# EAGLE schematic ADS1299 - Breakout (EAGLE 9.6.2)
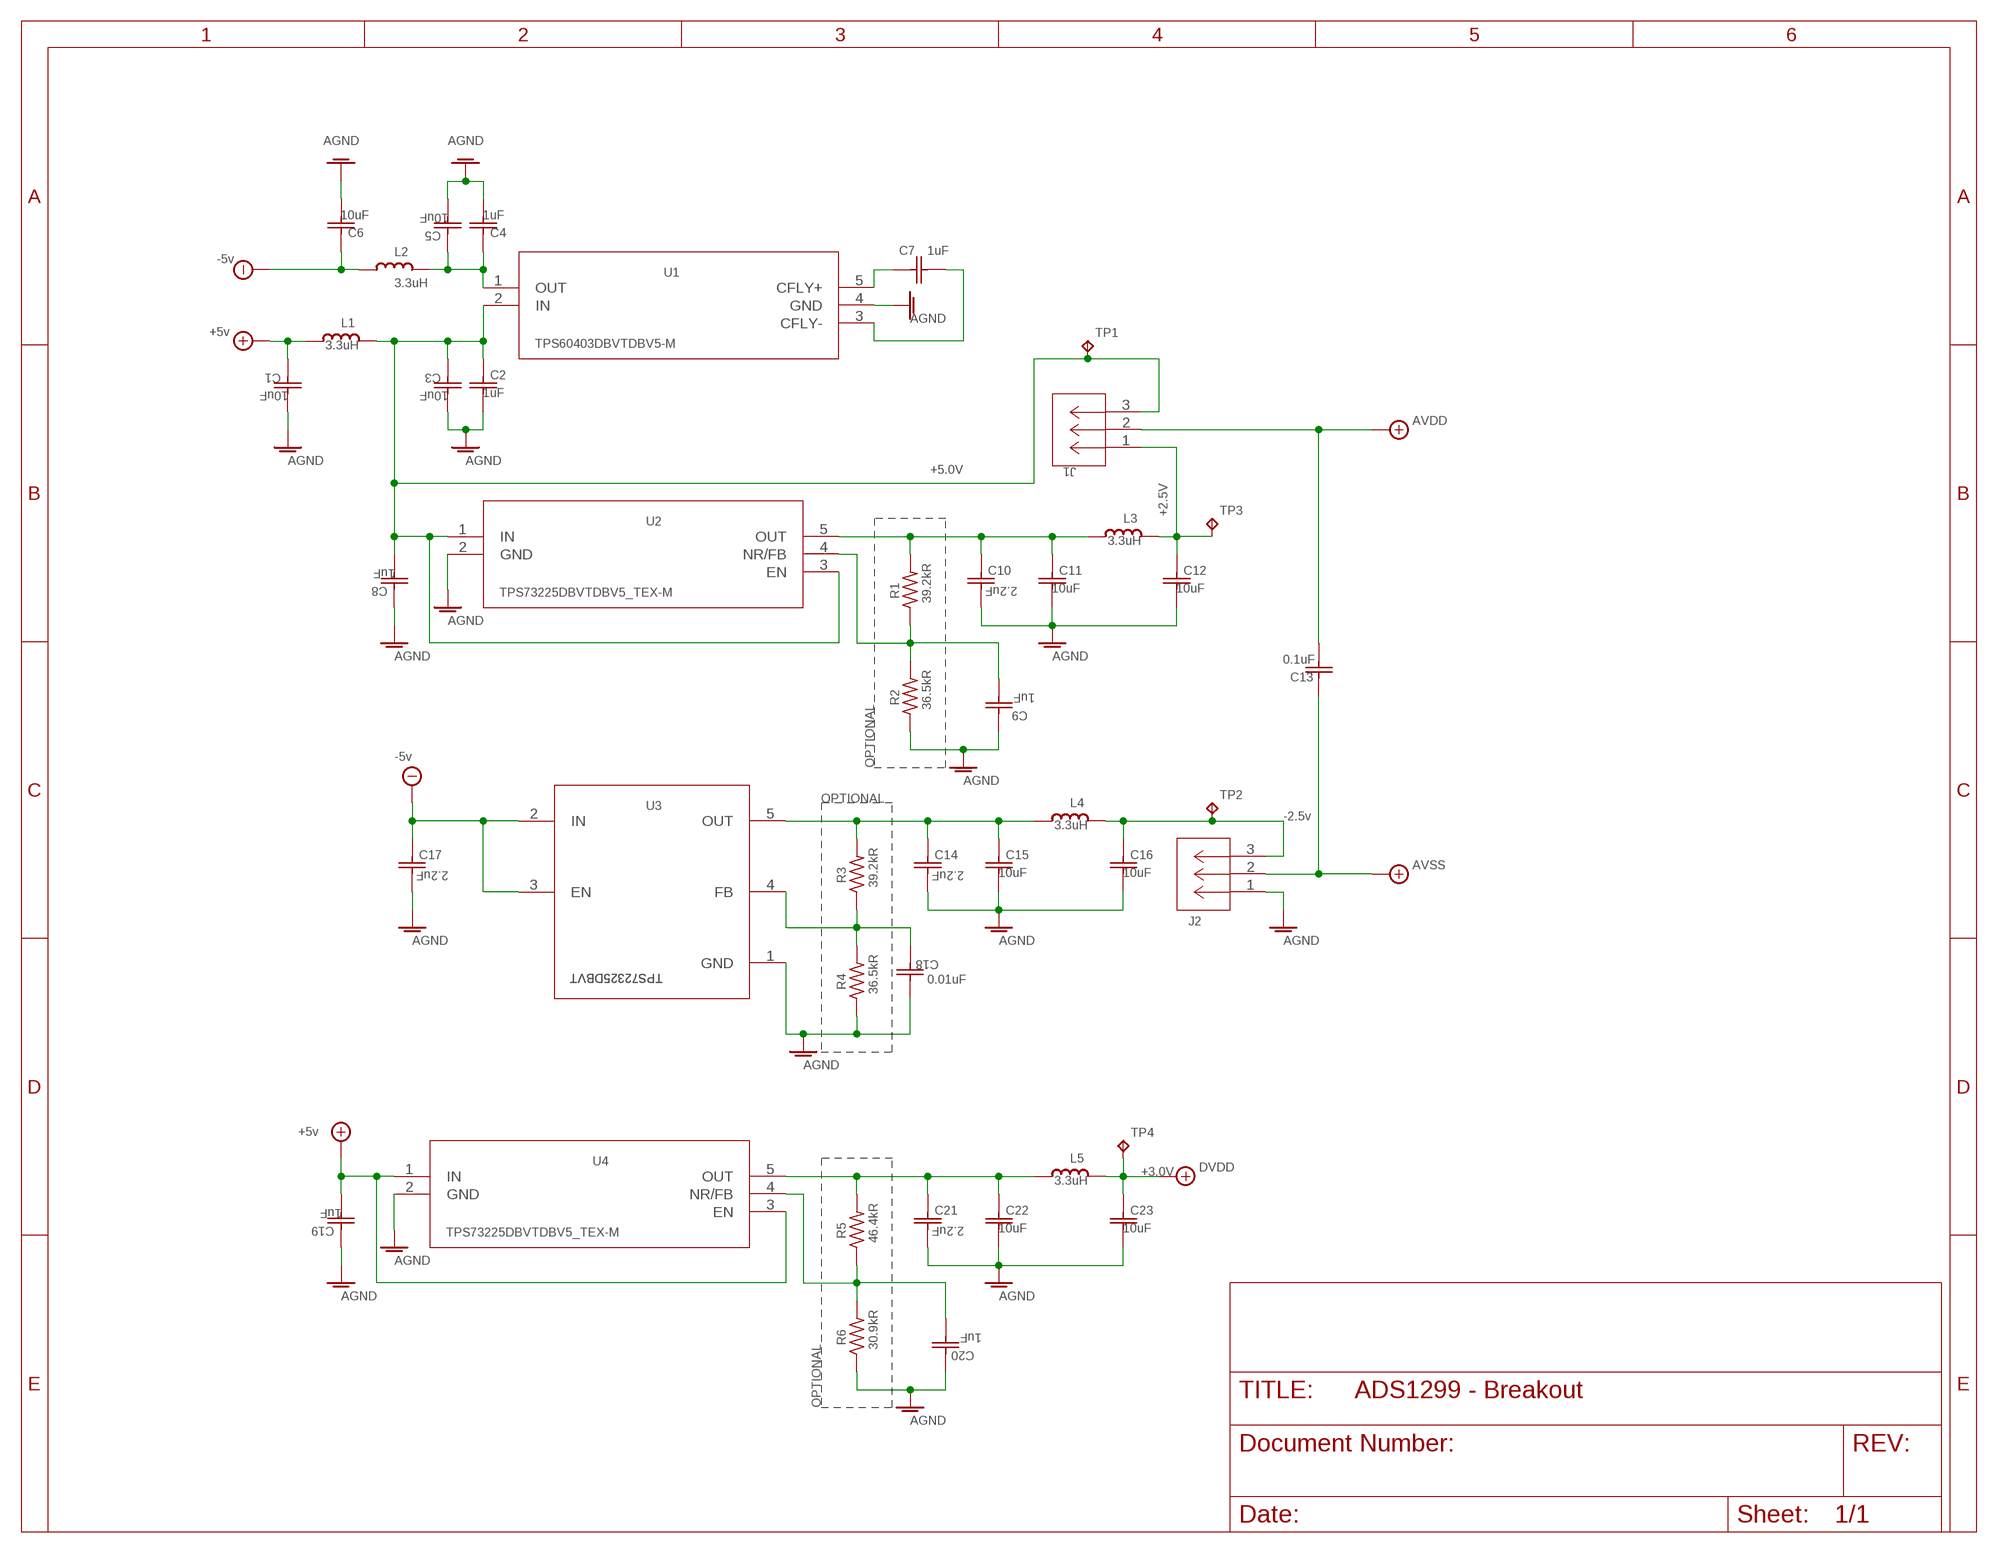
[diagram p0: schematic, sheet 1]

## Parts
C1  10uF  GRM219R61A106KE44DG-21_MUR-M  [G-21_MUR-M]
C2  1uF  GRM188R61E105KA12DG-188_MUR-M  [G-188_MUR-M]
C3  10uF  GRM219R61A106KE44DG-21_MUR-M  [G-21_MUR-M]
C4  1uF  GRM188R61E105KA12DG-188_MUR-M  [G-188_MUR-M]
C5  10uF  GRM219R61A106KE44DG-21_MUR-M  [G-21_MUR-M]
C6  10uF  GRM219R61A106KE44DG-21_MUR-M  [G-21_MUR-M]
C7  1uF  GRM188R61E105KA12DG-188_MUR-M  [G-188_MUR-M]
C8  1uF  GRM188R61E105KA12DG-188_MUR-M  [G-188_MUR-M]
C9  1uF  GRM188R61E105KA12DG-188_MUR-M  [G-188_MUR-M]
C10  2.2uF  GRM185R60J225KE26DCAP_GCJ1888_MUR-M  [CAP_GCJ1888_MUR-M]
C11  10uF  GRM219R61A106KE44DG-21_MUR-M  [G-21_MUR-M]
C12  10uF  GRM219R61A106KE44DG-21_MUR-M  [G-21_MUR-M]
C13  0.1uF  GRM188R71H104KA93DCAP_GRM_188_MUR-M  [CAP_GRM_188_MUR-M]
C14  2.2uF  GRM185R60J225KE26DCAP_GCJ1888_MUR-M  [CAP_GCJ1888_MUR-M]
C15  10uF  GRM219R61A106KE44DG-21_MUR-M  [G-21_MUR-M]
C16  10uF  GRM219R61A106KE44DG-21_MUR-M  [G-21_MUR-M]
C17  2.2uF  GRM185R60J225KE26DCAP_GCJ1888_MUR-M  [CAP_GCJ1888_MUR-M]
C18  0.01uF  GRM188R71H472KA01DG-188_MUR-M  [G-188_MUR-M]
C19  1uF  GRM188R61E105KA12DG-188_MUR-M  [G-188_MUR-M]
C20  1uF  GRM188R61E105KA12DG-188_MUR-M  [G-188_MUR-M]
C21  2.2uF  GRM185R60J225KE26DCAP_GCJ1888_MUR-M  [CAP_GCJ1888_MUR-M]
C22  10uF  GRM219R61A106KE44DG-21_MUR-M  [G-21_MUR-M]
C23  10uF  GRM219R61A106KE44DG-21_MUR-M  [G-21_MUR-M]
J1  TSW-103-07-T-S  [CON3_1X3_TU_TSW]
J2  TSW-103-07-T-S  [CON3_1X3_TU_TSW]
L1  3.3uH  L_0805  [L0805]
L2  3.3uH  L_0805  [L0805]
L3  3.3uH  L_0805  [L0805]
L4  3.3uH  L_0805  [L0805]
L5  3.3uH  L_0805  [L0805]
R1  39.2kR  R-US_R0603  [R0603]
R2  36.5kR  R-US_R0603  [R0603]
R3  39.2kR  R-US_R0603  [R0603]
R4  36.5kR  R-US_R0603  [R0603]
R5  46.4kR  R-US_R0603  [R0603]
R6  30.9kR  R-US_R0603  [R0603]
TP1  TP-040  [TP-040]
TP2  TP-040  [TP-040]
TP3  TP-040  [TP-040]
TP4  TP-040  [TP-040]
U1  TPS60403DBVTDBV5-M  [DBV5-M]
U2  TPS73225DBVTDBV5_TEX-M  [DBV5_TEX-M]
U3  TPS72325DBVT  [DBV0005A]
U4  TPS73225DBVTDBV5_TEX-M  [DBV5_TEX-M]

## Nets
+2.5V: C12.2 J1.1 L3.1 TP3.1
+3.0V: C23.2 L5.1 TP4.1 ; supply symbol labelled DVDD
+5.0V: C2.1 C3.1 C8.1 J1.3 L1.1 TP1.1 U1.2(IN) U2.1(IN) U2.3(EN)
+5V: C1.2 C13.1 C13.2 C19.1 J1.2 J2.2 L1.2 U4.1(IN) U4.3(EN) ; supply symbol labelled AVDD, AVSS, +5v
-5V: C6.1 C17.2 L2.2 U3.2(IN) U3.3(EN) ; supply symbol labelled -5v
AGND: C1.1 C2.2 C3.2 C4.2 C5.2 C6.2 C8.2 C9.2 C10.1 C11.1 C12.1 C14.1 C15.1 C16.1 C17.1 C18.1 C19.2 C20.2 C21.1 C22.1 C23.1 J2.1 R2.1 R4.1 R6.1 U1.4(GND) U2.2(GND) U3.1(GND) U4.2(GND)
N$1: C16.2 J2.3 L4.1 TP2.1
N$2: C4.1 C5.1 L2.1 U1.1(OUT)
N$3: C7.2 U1.5(CFLY+)
N$4: C7.1 U1.3(CFLY-)
N$5: C9.1 R1.1 R2.2 U2.4(NR/FB)
N$6: C10.2 C11.2 L3.2 R1.2 U2.5(OUT)
N$7: C14.2 C15.2 L4.2 R3.2 U3.5(OUT)
N$8: C18.2 R3.1 R4.2 U3.4(FB)
N$9: C20.1 R5.1 R6.2 U4.4(NR/FB)
N$10: C21.2 C22.2 L5.2 R5.2 U4.5(OUT)

## Notes on the sheet
- +5.0V
- OPTIONAL
- OPTIONAL
- -2.5v
- OPTIONAL

## Library data of the parts
C1 C3 C5 C6 C11 C12 C15 C16 C22 C23 = GRM219R61A106KE44D:GRM219R61A106KE44D; COPYRIGHT: Copyright (C) 2015 Accelerated Designs. All rights reserved; MANUFACTURER_PART_NUMBER: GRM219R61A106KE44D; SOURCELIBRARY: Murata_2014-12-31; VENDOR: Murata
C2 C4 C7-C9 C19 C20 = GRM188R61E105KA12D:GRM188R61E105KA12D; COPYRIGHT: Copyright (C) 2015 Accelerated Designs. All rights reserved; MANUFACTURER_PART_NUMBER: GRM188R61E105KA12D; SOURCELIBRARY: Murata_2014-12-31; VENDOR: Murata
C10 C14 C17 C21 = GRM185R60J225KE26D:GRM185R60J225KE26D; COPYRIGHT: Copyright (C) 2015 Accelerated Designs. All rights reserved; MANUFACTURER_PART_NUMBER: GRM185R60J225KE26D; SOURCELIBRARY: Murata_2014-12-31; VENDOR: Murata
C13 = GRM188R71H104KA93D:GRM188R71H104KA93D; CAPACITANCE: 0.1µF; COPYRIGHT: Copyright (C) 2015 Accelerated Designs. All rights reserved; CURRENT_RATING: Unknown; DATASHEET: http://search.murata.co.jp/Ceramy/image/img/PDF/ENG/GRM188R71H104KA93.pdf; DESCRIPTION: CAP CER .1UF 50V 10% X7R 0603; DIGIKEYPARTNUMBER: 490-1519-6-ND; FEATURES: General Purpose; HEADER_GROUP: Capacitors; HEADER_SECTION: Passives; LEAD_SPACING: -; MANUFACTURER_NAME: Murata; MANUFACTURER_PART_NUMBER: GRM188R71H104KA93D; MOUNTING: Surface Mount; MOUNTING_TYPE: Surface Mount, MLCC; OPERATING_TEMPERATURE: -55°C ~ 125°C; PACKAGE-CASE: 0603; PACKAGE_-_CASE: 0603 (1608 metric); PACKAGING: Digi-Reel®; QUANTITY_AVAILABLE: 3072080; R-S_NUMBER: 6242480; SOURCELIBRARY: Murata_2014-12-31; TEMPERATURE_COEFFICIENT: X7R; THICKNESS: 0.80mm; TOLERANCE: 0.1; VALUE: 100nF; VENDOR: Murata; VOLTAGE: Unknown; VOLTAGE_-_RATED: 50V
C18 = GRM188R71H472KA01D:GRM188R71H472KA01D; COPYRIGHT: Copyright (C) 2015 Accelerated Designs. All rights reserved; MANUFACTURER_PART_NUMBER: GRM188R71H472KA01D; SOURCELIBRARY: Murata_2014-12-31; VENDOR: Murata
J1 J2 = TSW-103-07-T-S:TSW-103-07-T-S; BUILT_BY: EMA_UL_Team; MANUFACTURER_PART_NUMBER: TSW-103-07-T-S; VENDOR: Samtec Inc
L1-L5 = rc-master-smd:L_: INDUCTOR
R1-R6 = rcl:R-US_: RESISTOR, American symbol; SPICEPREFIX: R
TP1-TP4 = keystone:TP: TEST POINT PCB Vertical Mount
U1 = TPS60403DBVT:TPS60403DBVT; DATASHEET_URL: http://www.ti.com/lit/gpn/TPS60403; DESCRIPTION: 60mA Charge Pump Voltage Inverter with Fixed 250kHz Operation; FAMILY_NAME: INVERTING CHARGE PUMP REGULATOR; GENERIC_PART_NUMBER: TPS60403; INDUSTRY_STD_PKG_TYPE: SOT-23; MANUFACTURER: Texas Instruments; MANUFACTURER_PART_NUMBER: TPS60403DBVT; PACKAGE_DESIGNATOR: DBV; PIN_COUNT: 5; VENDOR: Texas Instruments
U2 U4 = TPS73225DBVT:TPS73225DBVT; BUILT_BY: EMA_UL_Team; MANUFACTURER: Texas Instruments; MANUFACTURER_PART_NUMBER: TPS73225DBVT; SOURCELIBRARY: TI_2014-08-19; VENDOR: Texas Instruments
U3 = TPS72325DBVT:TPS72325DBVT; COMPTYPE: IC; MANUFACTURER: Texas Instruments; MOUNTTYPE: SMT; PACKAGEREFERENCE: DBV0005A; PARTNUMBER: TPS72301DBV; PIN_COUNT: 5; REFDES: RefDes; ROHS: Y; TYPE: TYPE; VALUE: Value